# Altium project Camera.PrjPcb
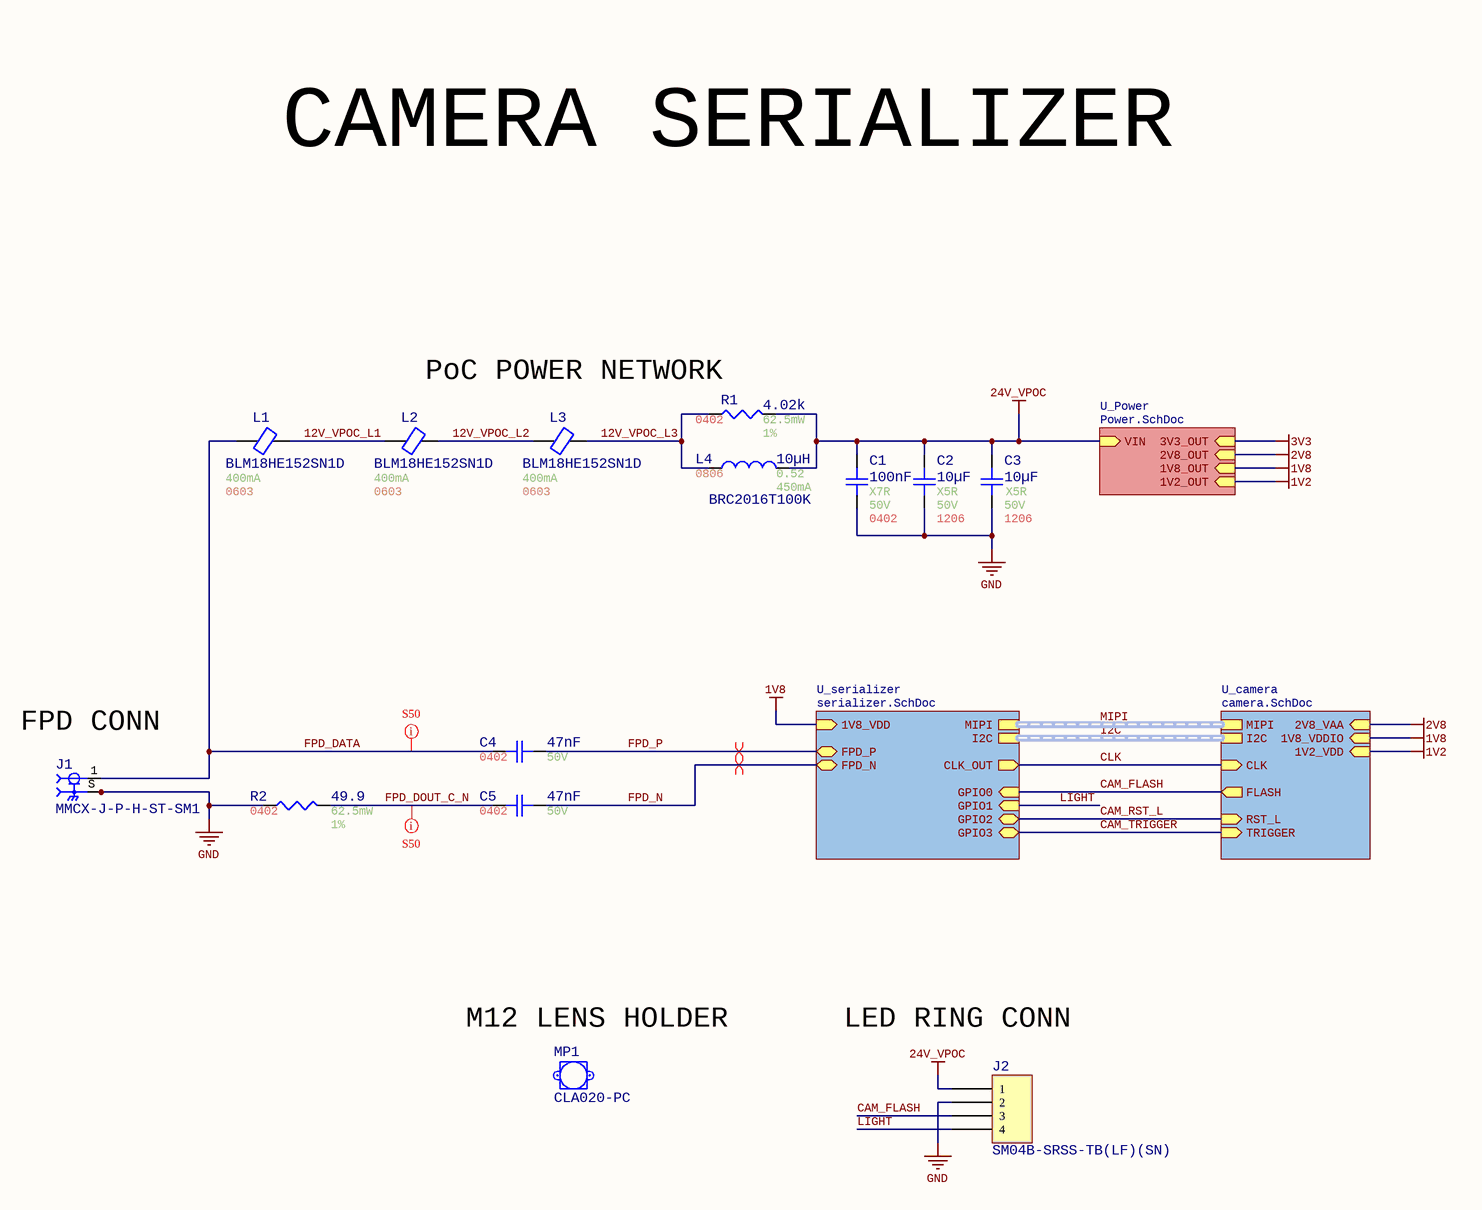
[diagram p0: Top.SchDoc]
PCBRevision: 0.0.1; ProjectTitle: Project; SchRevision: 0.1
2 sheets, 46 parts. Net scope: hierarchical (ports join the sheet entries above them; power ports are global).
Board file: Camera.PcbDoc
Sheets:
  Top.SchDoc
    U_Power = Power.SchDoc

## Sheet Top.SchDoc
size 431 x 279 mm; Author: Shivam Sharma; SheetNumber: 1; SheetTotal: 4; SheetRevision: 1.0

### Parts
C1  value 100nF  Temperature Coefficient: X7R  Voltage Rating: 50V  Case/Package: 0402  [Generic 0402 capacitor]  (hidden comment: GRT155R71H104KE01D)
C2  value 10µF  Temperature Coefficient: X5R  Voltage Rating: 50V  Case/Package: 1206  [Generic 1206 Capacitor]  (hidden comment: CL31A106MBHNNNE)
C3  value 10µF  Temperature Coefficient: X5R  Voltage Rating: 50V  Case/Package: 1206  [Generic 1206 Capacitor]  (hidden comment: CL31A106MBHNNNE)
C4  value 47nF  Voltage Rating: 50V  Case/Package: 0402  [Generic 0402 capacitor]  (hidden comment: GRM155R71H473KE14D)
C5  value 47nF  Voltage Rating: 50V  Case/Package: 0402  [Generic 0402 capacitor]  (hidden comment: GRM155R71H473KE14D)
J1  MMCX-J-P-H-ST-SM1  [MMCX-J-P-H-ST-SM1]
J2  SM04B-SRSS-TB(LF)(SN)  [JST SM04B-SRSS-TB]
L1  BLM18HE152SN1D  Current Rating: 400mA  Case/Package: 0603  [0603_1.6x0.8x0.8mm_IND]
L2  BLM18HE152SN1D  Current Rating: 400mA  Case/Package: 0603  [0603_1.6x0.8x0.8mm_IND]
L3  BLM18HE152SN1D  Current Rating: 400mA  Case/Package: 0603  [0603_1.6x0.8x0.8mm_IND]
L4  BRC2016T100K  value 10µH  DCR: 0.52  Current Rating: 450mA  Case/Package: 0806  [0805_2.0x1.6x1.6mm_IND]
MP1  CLA020-PC  [M12_lens_holder_20mm]
R1  value 4.02k  Power: 62.5mW  Tolerance: 1%  Case/Package: 0402  [Generic 0402 Resistor]  (hidden comment: RCA04024K02FKEDSR)
R2  value 49.9  Power: 62.5mW  Tolerance: 1%  Case/Package: 0402  [Generic 0402 Resistor]  (hidden comment: RMCA0402FT49R9-HP)

### Sub-sheets
U_camera = camera.SchDoc (file not in this document): MIPI (harness MIPI), 2V8_VAA (in), 1V8_VDDIO (in), 1V2_VDD (in), I2C (harness I2C), TRIGGER (in), RST_L (in), CLK (in), FLASH (out)
U_Power = Power.SchDoc: VIN (in), 1V2_OUT (in), 3V3_OUT (in), 2V8_OUT (in), 1V8_OUT (in)
U_serializer = serializer.SchDoc (file not in this document): MIPI (harness MIPI), 1V8_VDD (in), FPD_P (bidir), FPD_N (bidir), I2C (harness I2C), GPIO3 (bidir), GPIO2 (bidir), GPIO1 (in), GPIO0 (in), CLK_OUT (out)

### Nets
1V2: sheet U_camera/1V2_VDD, sheet U_Power/1V2_OUT  [project net 1V2_OUT]
1V8: sheet U_serializer/1V8_VDD, sheet U_camera/1V8_VDDIO, sheet U_Power/1V8_OUT  [project net 1V8_OUT]
2V8: sheet U_camera/2V8_VAA, sheet U_Power/2V8_OUT  [project net 2V8_OUT]
24V_VPOC: C1.2 C2.2 C3.2 J2.1 L4.2 R1.2 ; sheet U_Power/VIN
GND: C1.1 C2.1 C3.1 J1.S1 J1.S2 J1.S3 J1.S4 J2.2 R2.1
12V_VPOC_L1: L1.2 L2.1
12V_VPOC_L2: L2.2 L3.1
12V_VPOC_L3: L3.2 L4.1 R1.1
CAM_FLASH: J2.3 ; sheet U_serializer/GPIO0, sheet U_camera/FLASH
CAM_RST_L: sheet U_serializer/GPIO2, sheet U_camera/RST_L
CAM_TRIGGER: sheet U_serializer/GPIO3, sheet U_camera/TRIGGER
CLK: sheet U_serializer/CLK_OUT, sheet U_camera/CLK
FPD_DATA: C4.2 J1.1 L1.1
FPD_DOUT_C_N: C5.2 R2.2
FPD_N: C5.1 ; sheet U_serializer/FPD_N
FPD_P: C4.1 ; sheet U_serializer/FPD_P
LIGHT: J2.4 ; sheet U_serializer/GPIO1

### Buses and harness runs
harness I2C = sheet U_camera/I2C = sheet U_serializer/I2C
harness MIPI = sheet U_camera/MIPI = sheet U_serializer/MIPI

### Layout directives
net class S50: FPD_DATA, FPD_DOUT_C_N
differential pair: FPD_N, FPD_P

### Notes on the sheet
- CAMERA SERIALIZER
- PoC POWER NETWORK
- (near J1) FPD CONN
- (near MP1) M12 LENS HOLDER
- LED RING CONN
- Title:
- Author:
- Approved:
- Size:
- Date:
- Git Hash:
- Sch Revision:
- B
- Prj:
- Sheet Revision:
- Variant:
- Edited:
- CONFIDENTIAL
- File:
- (in symbol CMP-002-00135-2) S

### Library data of the parts
C1 = CMP-001-00084-12: Ceramic Capacitor, Multilayer, Ceramic, 50V, 10% +Tol, 10% -Tol, X7R, 15% TC, 0.1uF, Surface Mount, 0402; Multilayer: Yes; Terminal Finish: Nickel; Capacitor Type: Ceramic; Package Shape: Rectangular; Reach SVHC Compliant: Yes; Max Operating Temperature: 125°C; RoHS Compliant: Yes; Termination: Wraparound; Packaging: Tape and Reel; AECQ: Yes; Pins: 2; Dielectric Material: Ceramic; Min Operating Temperature: -55°C; Tolerance: 10%; Mounting Technology: Surface Mount
C2 C3 = CMP-001-00092-6: Ceramic Capacitor, Multilayer, Ceramic, 50V, 20% +Tol, 20% -Tol, X5R, 15% TC, 10uF, Surface Mount, 1206; AECQ: No; Multilayer: Yes; Reach SVHC Compliant: Yes; Package Shape: Rectangular; Temperature Characteristics Code: X5R; RoHS Compliant: Yes; Max Operating Temperature: 85°C; Mounting Technology: Surface Mount; Capacitor Type: Ceramic; Pins: 2; Packaging: Tape and Reel; Terminal Finish: Nickel; Tolerance: 20%; Termination: Wraparound; Dielectric Material: Ceramic; JESD-609 Code: e3; Min Operating Temperature: -55°C
C4 C5 = CMP-001-00113-1: 50V 47nF X7R ±10% 0402 Multilayer Ceramic Capacitors MLCC - SMD/SMT ROHS; AECQ: No; Mounting Technology: SMD; Tolerance: 10%; Pins: 2; Min Operating Temperature: -55°C; Max Operating Temperature: 125°C; Capacitor Type: Ceramic
J1 = CMP-002-00135-2: RF / Coaxial Connector, MMCX Coaxial, Straight Jack, Surface Mount Vertical, 50 ohm; Manufacturer: Samtec; Max Current Rating: 1.5A; Voltage Rating: 335V; Gender: Female; Connector Type: MMCX, Socket; Manufacturer Series: MMCX; Length: 3.45mm; Mounting Technology: Surface Mount; Pins: 2; Min Operating Temperature: -65°C; Case/Package: MMCX SMD; Max Operating Temperature: 125°C
J2 = SM04B-SRSS-TB(LF)(SN): CONN HEADER SMD R/A 4POS 1MM; Manufacturer: JST Sales America Inc.; Current Rating (Amps): 0.7A; Material Flammability Rating: UL94 V-0; Number of Positions: 4; Number of Positions Loaded: All; Pitch - Mating: 0.039" (1.00mm); Shrouding: Shrouded - 4 Wall; Style: Board to Cable/Wire; Voltage Rating: 50V; Part Number: SM04B-SRSS-TB(LF)(SN); ComponentLink1Description: Datasheet; ComponentLink1URL: http://www.jst-mfg.com/product/pdf/eng/eSH.pdf; ComponentLink2Description: DigiKey Link; ComponentLink2URL: http://digikey.com/product-detail/en/jst-sales-america-inc/SM04B-SRSS-TB-LF-SN/455-1804-1-ND/926875; Connector Type: Header; Contact Finish - Mating: Tin; Contact Finish - Post: Tin; Contact Material: Copper Alloy; Contact Shape: Square; Contact Type: Male Pin; Fastening Type: Push-Pull; Features: Solder Retention; Insulation Color: Natural; Insulation Height: 0.114" (2.90mm); Insulation Material: Polyamide (PA), Nylon; LastUpdated: 1/12/2020 11:41:52 PM; Lifecycle Status: Active; Minimum Order: 1; Mounting Type: Surface Mount, Right Angle; Number of Rows: 1; Operating Temperature: -25°C ~ 85°C; Packaging: TapeAndReel; PartId: 62; Part Status: Active; Price: 0.26; Series: SR; Supplier 1: DigiKey; Supplier Part Number 1: 455-1804-1-ND; Termination: Solder
L1-L3 = CMP-006-00026-1: Ferrite Beads Multi-Layer 1.5KOhm 25% 100MHz 500mA 500mOhm DCR 0603 T/R; Current - Saturation: 13.3A; AECQ: no; DCR: 20.5m; Shileded: Yes; Height: 800µm; Max Operating Temperature: 125°C; Pins: 2; Tolerance: 25%; Min Operating Temperature: -55°C
L4 = CMP-006-00025-2: IND 10UH 20% 3.1A SHD; Shileded: Yes; Tolerance: 10%; Self Resonant Frequency: 35MHz; Current - Saturation: 3.3A; AECQ: No; Pins: 2; Height: 1.6mm; Min Operating Temperature: -40°C; Max Operating Temperature: 105°C
MP1 = CMP-00015-2: M12 camera lens holder - 20mm spacing
R1 = CMP-009-00241-1: Fixed Resistor, Metal Glaze/Thick Film, 0.063W, 4020ohm, 50V, 1% +/-Tol, Surface Mount, 0402; Manufacturer Part Number: Blank; AECQ: Yes; Pins: 2; Voltage Rating: 50V; Max Operating Temperature: 155°C; Min Operating Temperature: -55°C; Mounting Technology: SMD
R2 = CMP-009-00240-1: RES, 0402, 49.9 ohm, 1%, 0.1W, AUTO; AECQ: Yes; Voltage Rating: 50V; Min Operating Temperature: -55°C; Mounting Technology: SMD; Manufacturer Part Number: RMCA0402FT49R9-HP; Max Operating Temperature: 155°C; Pins: 2

## Sheet Power.SchDoc: POWER
size 431 x 279 mm; SheetNumber: 3; SheetTotal: 4; SheetRevision: 1.0
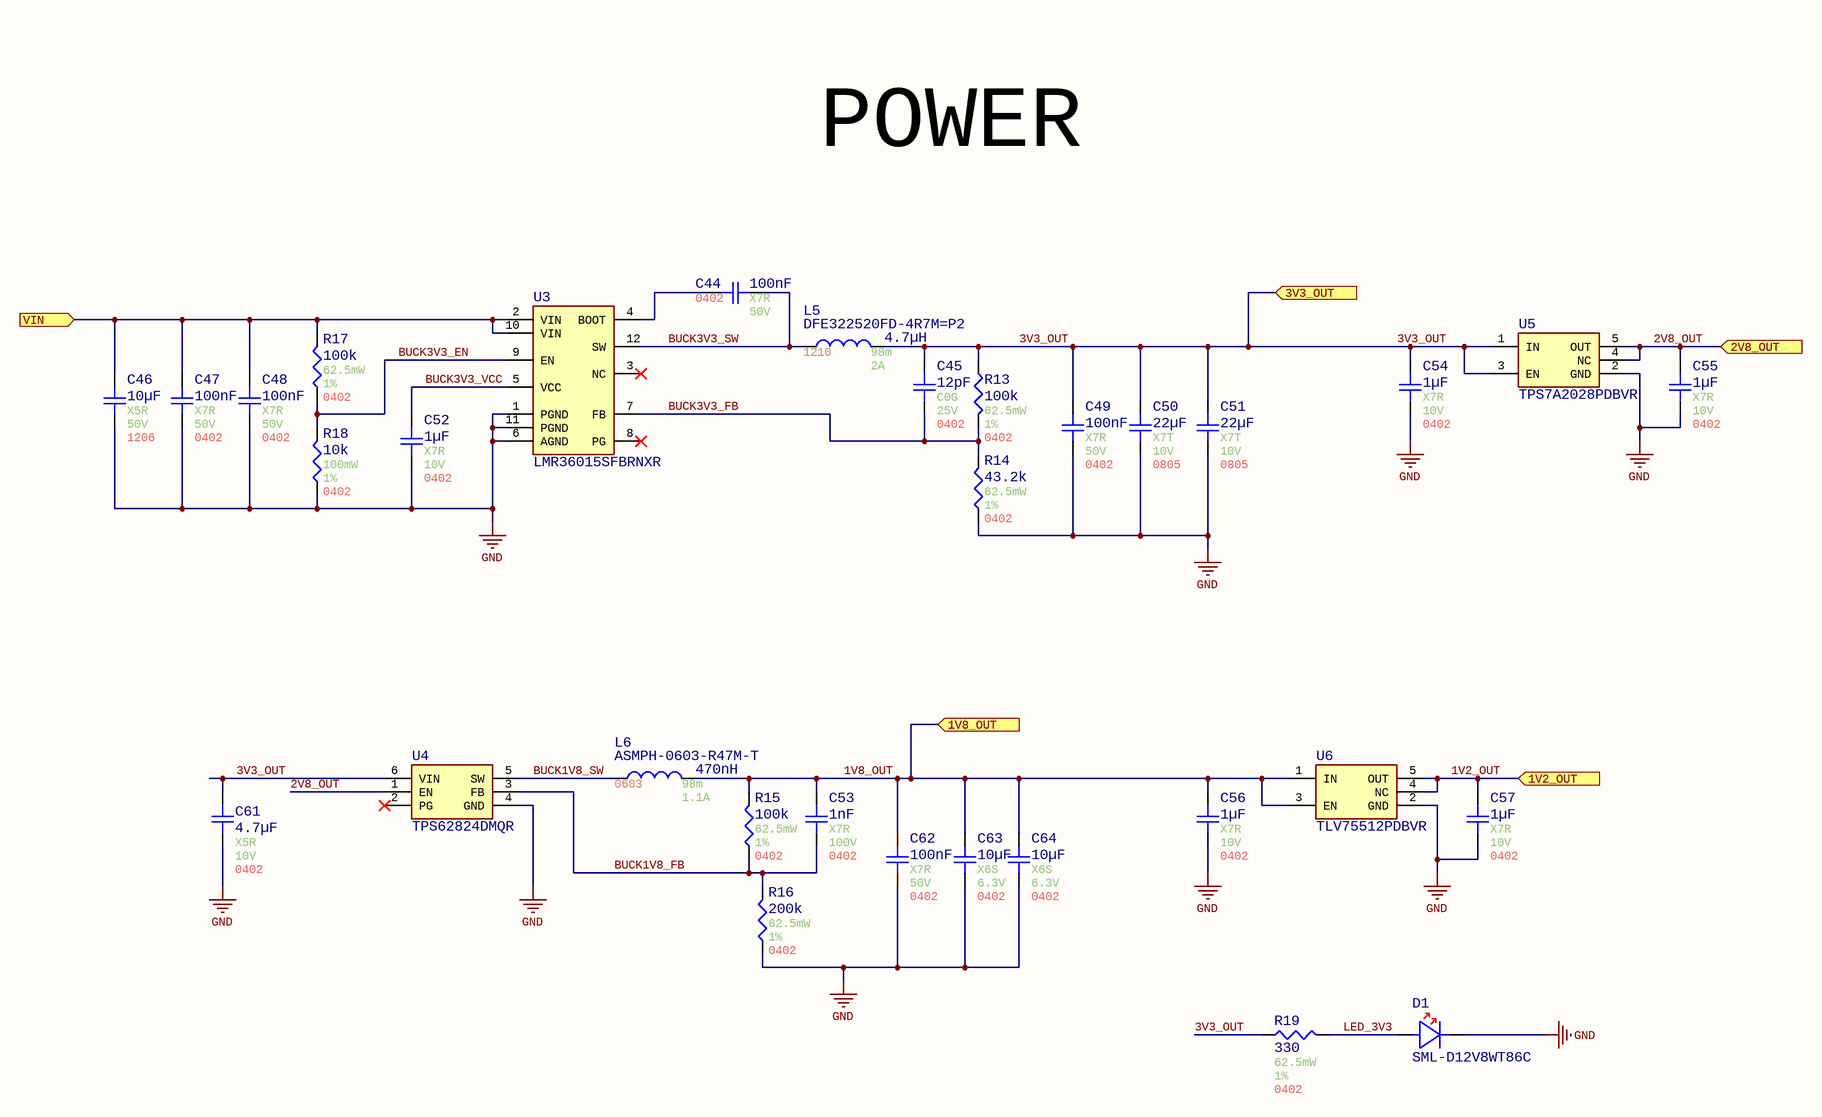
[diagram p1: Power.SchDoc]

### Parts
C44  value 100nF  Temperature Coefficient: X7R  Voltage Rating: 50V  Case/Package: 0402  [Generic 0402 capacitor]  (hidden comment: GRT155R71H104KE01D)
C45  value 12pF  Temperature Coefficient: C0G  Voltage Rating: 25V  Case/Package: 0402  [Generic 0402 capacitor]  (hidden comment: GRT1555C1E120JA02J)
C46  value 10µF  Temperature Coefficient: X5R  Voltage Rating: 50V  Case/Package: 1206  [Generic 1206 Capacitor]  (hidden comment: CL31A106MBHNNNE)
C47  value 100nF  Temperature Coefficient: X7R  Voltage Rating: 50V  Case/Package: 0402  [Generic 0402 capacitor]  (hidden comment: GRT155R71H104KE01D)
C48  value 100nF  Temperature Coefficient: X7R  Voltage Rating: 50V  Case/Package: 0402  [Generic 0402 capacitor]  (hidden comment: GRT155R71H104KE01D)
C49  value 100nF  Temperature Coefficient: X7R  Voltage Rating: 50V  Case/Package: 0402  [Generic 0402 capacitor]  (hidden comment: GRT155R71H104KE01D)
C50  value 22µF  Temperature Coefficient: X7T  Voltage Rating: 10V  Case/Package: 0805  [Generic 0805 Cap]  (hidden comment: GRT21BD71A226ME13L)
C51  value 22µF  Temperature Coefficient: X7T  Voltage Rating: 10V  Case/Package: 0805  [Generic 0805 Cap]  (hidden comment: GRT21BD71A226ME13L)
C52  value 1µF  Temperature Coefficient: X7R  Voltage Rating: 10V  Case/Package: 0402  [Generic 0402 capacitor]  (hidden comment: MAASL105CD7105MFCA01)
C53  value 1nF  Temperature Coefficient: X7R  Voltage Rating: 100V  Case/Package: 0402  [Generic 0402 capacitor]  (hidden comment: GCM155R72A102KA37J)
C54  value 1µF  Temperature Coefficient: X7R  Voltage Rating: 10V  Case/Package: 0402  [Generic 0402 capacitor]  (hidden comment: MAASL105CD7105MFCA01)
C55  value 1µF  Temperature Coefficient: X7R  Voltage Rating: 10V  Case/Package: 0402  [Generic 0402 capacitor]  (hidden comment: MAASL105CD7105MFCA01)
C56  value 1µF  Temperature Coefficient: X7R  Voltage Rating: 10V  Case/Package: 0402  [Generic 0402 capacitor]  (hidden comment: MAASL105CD7105MFCA01)
C57  value 1µF  Temperature Coefficient: X7R  Voltage Rating: 10V  Case/Package: 0402  [Generic 0402 capacitor]  (hidden comment: MAASL105CD7105MFCA01)
C61  value 4.7µF  Temperature Coefficient: X5R  Voltage Rating: 10V  Case/Package: 0402  [Generic 0402 capacitor]  (hidden comment: GRT155R61A475ME13D)
C62  value 100nF  Temperature Coefficient: X7R  Voltage Rating: 50V  Case/Package: 0402  [Generic 0402 capacitor]  (hidden comment: GRT155R71H104KE01D)
C63  value 10µF  Temperature Coefficient: X6S  Voltage Rating: 6.3V  Case/Package: 0402  [Generic 0402 capacitor]  (hidden comment: GRT155C80J106ME13J)
C64  value 10µF  Temperature Coefficient: X6S  Voltage Rating: 6.3V  Case/Package: 0402  [Generic 0402 capacitor]  (hidden comment: GRT155C80J106ME13J)
D1  SML-D12V8WT86C  [FP-SML-D12-MFG]
L5  DFE322520FD-4R7M=P2  value 4.7µH  DCR: 98m  Current Rating: 2A  Case/Package: 1210  [FP-DFE322520F_D-IPC_A]
L6  ASMPH-0603-R47M-T  value 470nH  DCR: 98m  Current Rating: 1.1A  Case/Package: 0603  [0603_1.6x0.8x0.8mm_IND]
R13  value 100k  Power: 62.5mW  Tolerance: 1%  Case/Package: 0402  [Generic 0402 Resistor]  (hidden comment: WR04X1003FTL)
R14  value 43.2k  Power: 62.5mW  Tolerance: 1%  Case/Package: 0402  [Generic 0402 Resistor]  (hidden comment: CR0402-FX-4322GLF)
R15  value 100k  Power: 62.5mW  Tolerance: 1%  Case/Package: 0402  [Generic 0402 Resistor]  (hidden comment: WR04X1003FTL)
R16  value 200k  Power: 62.5mW  Tolerance: 1%  Case/Package: 0402  [Generic 0402 Resistor]  (hidden comment: 560112110041)
R17  value 100k  Power: 62.5mW  Tolerance: 1%  Case/Package: 0402  [Generic 0402 Resistor]  (hidden comment: WR04X1003FTL)
R18  value 10k  Power: 100mW  Tolerance: 1%  Case/Package: 0402  [Generic 0402 Resistor]  (hidden comment: RNCP0402FTD10K0)
R19  value 330  Power: 62.5mW  Tolerance: 1%  Case/Package: 0402  [Generic 0402 Resistor]  (hidden comment: RMCF0402FT330R)
U3  LMR36015SFBRNXR  [VQFN_HR-12_3x2x1.0mm_P0.5mm]
U4  TPS62824DMQR  [VSON_HR-6_1.5x1.5x1.0mm_P0.5mm]
U5  TPS7A2028PDBVR  [SOT23-3_3x5x1.1mm_P0.95mm]
U6  TLV75512PDBVR  [SOT23-3_3x5x1.1mm_P0.95mm]

### Ports
1V2_OUT (in), 1V8_OUT (in), 2V8_OUT (in), 3V3_OUT (in), VIN (in)

### Nets
1V2_OUT: C57.2 U6.4(NC) U6.5(OUT) ; port 1V2_OUT
1V8_OUT: C53.2 C56.2 C62.1 C63.2 C64.2 L6.2 R15.2 U6.1(IN) U6.3(EN) ; port 1V8_OUT
2V8_OUT: C55.2 U4.1(EN) U5.4(NC) U5.5(OUT) ; port 2V8_OUT
3V3_OUT: C45.1 C49.1 C50.2 C51.2 C54.2 C61.1 L5.2 R13.1 R19.1 U4.6(VIN) U5.1(IN) U5.3(EN) ; port 3V3_OUT
24V_VPOC: C46.2 C47.1 C48.1 R17.2 U3.2(VIN) U3.10(VIN) ; port VIN
GND: C46.1 C47.2 C48.2 C49.2 C50.1 C51.1 C52.1 C54.1 C55.1 C56.1 C57.1 C61.2 C62.2 C63.1 C64.1 D1.1(C) R14.1 R16.1 R18.1 U3.1(PGND) U3.6(AGND) U3.11(PGND) U4.4(GND) U5.2(GND) U6.2(GND)
BUCK1V8_FB: C53.1 R15.1 R16.2 U4.3(FB)
BUCK1V8_SW: L6.1 U4.5(SW)
BUCK3V3_EN: R17.1 R18.2 U3.9(EN)
BUCK3V3_FB: C45.2 R13.2 R14.2 U3.7(FB)
BUCK3V3_SW: C44.2 L5.1 U3.12(SW)
BUCK3V3_VCC: C52.2 U3.5(VCC)
LED_3V3: D1.2(A) R19.2
NetC44_1: C44.1 U3.4(BOOT)

Not connected (* = marked no-connect by the designer): U3 3(NC)* 8(PG)*; U4 2(PG)*

### Notes on the sheet
- POWER
- Title:
- Author:
- Approved:
- Size:
- Date:
- Git Hash:
- Sch Revision:
- B
- Prj:
- Sheet Revision:
- Variant:
- Edited:
- CONFIDENTIAL
- File:

### Library data of the parts
C44 C47-C49 C62 = CMP-001-00084-12: as C1 on sheet Top; Terminal Finish: Nickel; Capacitor Type: Ceramic; Package Shape: Rectangular; Reach SVHC Compliant: Yes; Max Operating Temperature: 125°C; RoHS Compliant: Yes; Termination: Wraparound; Packaging: Tape and Reel; AECQ: Yes; Pins: 2; Dielectric Material: Ceramic; Min Operating Temperature: -55°C; Tolerance: 10%; Mounting Technology: Surface Mount
C45 = CMP-001-00109-2: Ceramic Capacitor, Multilayer, Ceramic, 25V, 5% +Tol, 5% -Tol, C0G, 30ppm/Cel TC, 0.000012uF, Surface Mount, 0402; AECQ: Yes; Pins: 2; RoHS Compliant: Yes; Max Operating Temperature: 125°C; Mounting Technology: Surface Mount; Capacitor Type: Ceramic; Min Operating Temperature: -55°C; Tolerance: 5%
C46 = CMP-001-00092-6: as C2 on sheet Top; Reach SVHC Compliant: Yes; Package Shape: Rectangular; Temperature Characteristics Code: X5R; RoHS Compliant: Yes; Max Operating Temperature: 85°C; Mounting Technology: Surface Mount; Capacitor Type: Ceramic; Pins: 2; Packaging: Tape and Reel; Terminal Finish: Nickel; Tolerance: 20%; Termination: Wraparound; Dielectric Material: Ceramic; JESD-609 Code: e3; Min Operating Temperature: -55°C
C50 C51 = CMP-001-00095-2: 22 µF ±20% 10V Ceramic Capacitor X7T 0805 (2012 Metric); AECQ: Yes; Tolerance: 20%; Capacitor Type: Ceramic; Max Operating Temperature: 125°C; Pins: 2; Min Operating Temperature: -55°C; Mounting Technology: SMD
C52 C54-C57 = CMP-001-00104-2: Cap Cer 1UF 20V X7T 0402; AECQ: Yes; Capacitor Type: Ceramic; Tolerance: 20%; Min Operating Temperature: -55°C; Max Operating Temperature: 125°C; Pins: 2; RoHS Compliant: Yes; Mounting Technology: Surface Mount
C53 = CMP-001-00101-2: Ceramic Capacitor, Multilayer, Ceramic, 100V, 10% +Tol, 10% -Tol, X7R, 15% TC, 0.001uF, Surface Mount, 0402; AECQ: Yes; Min Operating Temperature: -55°C; Max Operating Temperature: 125°C; Pins: 2; Mounting Technology: SMD; Tolerance: 10%; Capacitor Type: Ceramic
C61 = CMP-001-00085-5: Ceramic Capacitor, Multilayer, Ceramic, 10V, 20% +Tol, 20% -Tol, X5R, 15% TC, 4.7uF, Surface Mount, 0402; Multilayer: Yes; Tolerance: 0%; Reach SVHC Compliant: Yes; Tolerance (fill in as +-): 20%; Packaging: Tape and Reel; Dielectric Material: Ceramic; Mounting Technology: Surface Mount; RoHS Compliant: Yes; Tolerance  (fill in as +-): 20%; Rated DC Voltage (URdc): 10V; Package Shape: Rectangular; Termination: Wraparound; Pins: 2; Max Operating Temperature: 85°C; Capacitor Type: Ceramic; Min Operating Temperature: -55°C; AECQ: Yes
C63 C64 = CMP-001-00108-2: Multilayer Ceramic Capacitors MLCC - SMD/SMT 0402 10uF 6.3VDC 20% X6S AEC-Q200; AECQ: Yes; Mounting Technology: Surface Mount; RoHS Compliant: Yes; Pins: 2; Min Operating Temperature: -55°C; Capacitor Type: Ceramic; Tolerance: 20%; Max Operating Temperature: 105°C
D1 = CMP-007-00036-1: Red 630nm LED Indication - Discrete 2.2V 0603 (1608 Metric); Case/Package: 0603; Forward Voltage: 2.2V; Colour: Red; Pins: 2
L5 = CMP-006-00022-5: General Purpose Inductor, 4.7uH, 20%, 1 Element, Metal Alloy-Core, SMD, 1210; AECQ: Yes; ComponentLink2Description: https://www.bourns.com/docs/Product-Datasheets/SRP4021HMCT.pdf; Min Operating Temperature: -40°C; Tolerance: 20%; Max Operating Temperature: 125°C; Pins: 2
L6 = CMP-006-00028-1: Inductor Power Shielded Multi-Layer 0.47uH 20% 1MHz Ferrite 1.1A 0.19Ohm DCR 0603 T/R; Self Resonant Frequency: 180MHz; AECQ: No; Shileded: Yes; Current - Saturation: 1.8A; Pins: 2; Max Operating Temperature: 125°C; Min Operating Temperature: -55°C; Tolerance: 20%; Height: 800µm; Mounting Technology: SMT
R13 R15 R17 = CMP-009-00188-7: Fixed Resistor, Metal Glaze/thick Film, 0.0625W, 100000ohm, 50V, 1% +/-Tol, 100ppm/Cel, Surface Mount, 0402; Manufacturer Part Number: Blank; Package Height: 0.35mm; AECQ: No; Temperature Coefficient (ppm/Cel): 100; Package Length: 1mm; Package Width: 0.5mm; Additional Feature: LASER TRIMMABLE; Rated Temperature: 70°C; Construction: Chip; RoHS Compliant: Yes; Resistor Type: FIXED RESISTOR; Min Operating Temperature: -55°C; Pins: 2; Technology: METAL GLAZE/THICK FILM; Reach SVHC Compliant: Yes; Working Voltage: 50V; JESD-609 Code: e3; Mounting Technology: Surface Mount; Max Operating Temperature: 155°C; Termination: Wraparound; Terminal Finish: Nickel; Packaging: Tape and Reel; Package Shape: Rectangular
R14 = CMP-009-00247-1: Fixed Resistor, Metal Glaze/Thick Film, 0.0625W, 43200ohm, 50V, 1% +/-Tol, Surface Mount, 0402; AECQ: No; Pins: 2; Mounting Technology: Surface Mount; Min Operating Temperature: -55°C; Max Operating Temperature: 155°C; RoHS Compliant: Yes; Voltage Rating: 50V
R16 = CMP-009-00248-1: Resistor, 200K, 0.1W, Thick Film, 0402;; AECQ: Yes; Voltage Rating: 50V; Pins: 2; Max Operating Temperature: 155°C; Mounting Technology: Surface Mount; Min Operating Temperature: -55°C; RoHS Compliant: Yes
R18 = CMP-009-00242-1: Fixed Resistor, Thin Film, 0.1W, 10000ohm, 50V, 1% +/-Tol, 100ppm/Cel, Surface Mount, 0402; Manufacturer Part Number: Blank; AECQ: Yes; Pins: 2; Max Operating Temperature: 155°C; Voltage Rating: 50V; Mounting Technology: SMD; Min Operating Temperature: -55°C
R19 = CMP-009-00225-1: Res Thick Film 0402 330 Ohm 1% 0.063W ±100ppm/°C Molded SMD Paper T/R; AECQ: Yes; Mounting Technology: Surface Mount; Max Operating Temperature: 155°C; RoHS Compliant: Yes; Pins: 2; Min Operating Temperature: -55°C
U3 = CMP-019-00065-1: IC REG BUCK ADJ 1.5A 12VQFN Buck Switching Regulator IC Positive Adjustable 1V 1 Output 1.5A 12-VFQFN; Frequency: 1.7MHz; Max Supply Voltage: 17V; Output Current: 1A; Output Voltage: 3.3V; Min Supply Voltage: 3V; Case/Package: 12-VQFN (3x2); Pins: 12; RoHS Compliant: Yes; Min Operating Temperature: -40°C; Mounting Technology: SMD; Max Operating Temperature: 125°C
U4 = CMP-019-00068-1: IC REG BUCK ADJ 1A 6VSON Buck Switching Regulator IC Positive Adjustable 0.6V 1 Output 1A 6-VFDFN; Min Supply Voltage: 2.4V; Max Supply Voltage: 5.5V; Frequency: 2.2MHz; Output Current: 1A; Case/Package: 6-VSON-HR (1.5x1.5); Pins: 6; Min Operating Temperature: -40°C; RoHS Compliant: Yes; Max Operating Temperature: 125°C; Mounting Technology: SMD
U5 = CMP-019-00066-2: 300mA ultra-low-noise low-IQ low-dropout (LDO) linear regulator with high PSRR 5-SOT-23 -40 to 125; Min Supply Voltage: 3.1V; Dropout Voltage: 145mV; Output Voltage: 2.8V; Frequency: 1.7MHz; Max Supply Voltage: 6V; Min Operating Temperature: -40°C; Mounting Technology: SMD; Case/Package: SOT-23; Pins: 5; Output Current: 300mA; RoHS Compliant: Yes; Max Operating Temperature: 125°C
U6 = CMP-019-00067-2: 500mA high-PSRR low-IQ low-dropout voltage regulator with enable 5-SOT-23 -40 to 125; Max Supply Voltage: 5.5V; Nominal Supply Current: 25µA; Dropout Voltage: 238mV; Min Supply Voltage: 1.45V; Frequency: 1.7MHz; Output Voltage: 1.2V; Min Operating Temperature: -40°C; Case/Package: SOT-23; RoHS Compliant: Yes; Max Operating Temperature: 125°C; Output Current: 500mA; Mounting Technology: SMD; Pins: 5

## Nets that join several sheets
24V_VPOC: Top (6 pins), Power (6 pins)
GND: Top (9 pins), Power (25 pins)

## Assembly variants
Main: all parts fitted